# EAGLE schematic Schematic_Eagle (EAGLE 9.6.2)
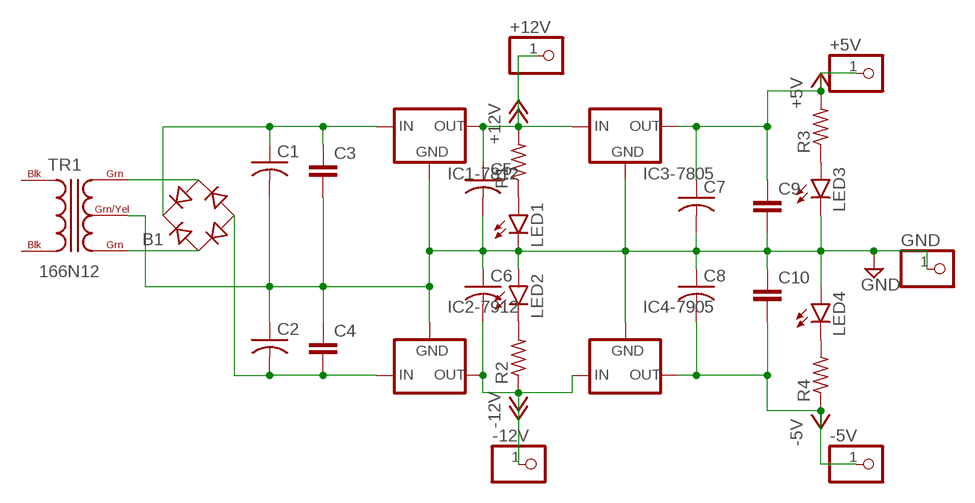
[diagram p0: schematic, sheet 1]

## Parts
+5V  PINHD-1X1  [1X01]
+12V  PINHD-1X1  [1X01]
-5V  PINHD-1X1  [1X01]
-12V  PINHD-1X1  [1X01]
B1  RB1A  [RB1A]
C1  C-US025-025X050  [C025-025X050]
C2  C-US025-025X050  [C025-025X050]
C3  C-EU025-025X050  [C025-025X050]
C4  C-EU025-025X050  [C025-025X050]
C5  C-US025-025X050  [C025-025X050]
C6  C-US025-025X050  [C025-025X050]
C7  C-US025-025X050  [C025-025X050]
C8  C-US025-025X050  [C025-025X050]
C9  C-EU025-025X050  [C025-025X050]
C10  C-EU025-025X050  [C025-025X050]
GND  PINHD-1X1  [1X01]
IC1-7812  78XXL  [78XXL]
IC2-7912  79XXL  [79XXL]
IC3-7805  78XXL  [78XXL]
IC4-7905  79XXL  [79XXL]
LED1  LED5MM  [LED5MM]
LED2  LED5MM  [LED5MM]
LED3  LED5MM  [LED5MM]
LED4  LED5MM  [LED5MM]
R1  R-US_0204/7  [0204/7]
R2  R-US_0204/7  [0204/7]
R3  R-US_0204/7  [0204/7]
R4  R-US_0204/7  [0204/7]
TR1  166N12  [C13H]

## Nets
+5V: +5V.1 C7.1 C9.1 IC3-7805.OUT R3.2
+12V: +12V.1 C5.1 IC1-7812.OUT IC3-7805.IN R1.2
-5V: -5V.1 C8.2 C10.2 IC4-7905.OUT R4.1
-12V: -12V.1 C6.2 IC2-7912.OUT IC4-7905.IN R2.1
GND: C1.2 C2.1 C3.2 C4.1 C5.2 C6.1 C7.2 C8.1 C9.2 C10.1 GND.1 IC1-7812.GND IC2-7912.GND IC3-7805.GND IC4-7905.GND LED1.K(C) LED2.A LED3.K(C) LED4.A TR1.GRN/YEL
N$1: B1.AC1 TR1.GRN@2(GRN)
N$2: B1.AC2 TR1.GRN@1(GRN)
N$3: B1.+ C1.1 C3.1 IC1-7812.IN
N$4: B1.- C2.2 C4.2 IC2-7912.IN
N$10: LED1.A R1.1
N$11: LED2.K(C) R2.2
N$13: LED3.A R3.1
N$18: LED4.K(C) R4.2
Unconnected: TR1.BLK@1(BLK) TR1.BLK@2(BLK)

## Library data of the parts
+5V +12V -5V -12V GND = pinhead:PINHD-1X1: PIN HEADER
B1 = rectifier:RB1A: RECTIFIER 1 A
C1 C2 C5-C8 = rcl:C-US: CAPACITOR, American symbol; SPICEPREFIX: C
C3 C4 C9 C10 = rcl:C-EU: CAPACITOR, European symbol; SPICEPREFIX: C
IC1-7812 IC3-7805 = v-reg:78XXL: VOLTAGE REGULATOR
IC2-7912 IC4-7905 = v-reg:79XXL: VOLTAGE REGULATOR
LED1-LED4 = led:LED: LED OSRAM: - CHIPLED LG R971, LG N971, LY N971, LG Q971, LY Q971, LO R971, LY R971 LH N974, LH R974 LS Q976, LO Q976, LY Q976 LO Q996 - Hyper CHIPLED LW Q18S LB Q993, LB Q99A, LB R99A - SideLED LS A670, LO A670, LY A670, LG A670, LP A670 LB A673, LV A673, LT A673, LW A673 LH A674 LY A675 LS A676, LA A676, LO A676, LY A676, LW A676 LS A679, LY A679, LG A679 - Hyper Micro SIDELED® LS Y876, LA Y876, LO Y876, LY Y876 LT Y87S - SmartLED LW L88C, LW L88S LB L89C, LB L89S, LG L890 LS L89K, LO L89K, LY L89K LS L896, LA L896, LO L896, LY L896 - TOPLED LS T670, LO T670, LY T670, LG T670, LP T670 LSG T670, LSP T670, LSY T670, LOP T670, LYG T670 LG T671, LOG T671, LSG T671 LB T673, LV T673, LT T673, LW T673 LH T674 LS T676, LA T676, LO T676, LY T676, LB T676, LH T676, LSB T676, LW T676 LB T67C, LV T67C, LT T67C, LS T67K, LO T67K, LY T67K, LW E67C LS E67B, LA E67B, LO E67B, LY E67B, LB E67C, LV E67C, LT E67C LW T67C LS T679, LY T679, LG T679 LS T770, LO T770, LY T770, LG T770, LP T770 LB T773, LV T773, LT T773, LW T773 LH T774 LS E675, LA E675, LY E675, LS T675 LS T776, LA T776, LO T776, LY T776, LB T776 LHGB T686 LT T68C, LB T68C - Hyper Mini TOPLED® LB M676 - Mini TOPLED Santana® LG M470 LS M47K, LO M47K, LY M47K Source: http://www.osram.convergy.de LUXEON: - LUMILED® LXK2-PW12-R00, LXK2-PW12-S00, LXK2-PW14-U00, LXK2-PW14-V00 LXK2-PM12-R00, LXK2-PM12-S00, LXK2-PM14-U00 LXK2-PE12-Q00, LXK2-PE12-R00, LXK2-PE12-S00, LXK2-PE14-T00, LXK2-PE14-U00 LXK2-PB12-K00, LXK2-PB12-L00, LXK2-PB12-M00, LXK2-PB14-N00, LXK2-PB14-P00, LXK2-PB14-Q00 LXK2-PR12-L00, LXK2-PR12-M00, LXK2-PR14-Q00, LXK2-PR14-R00 LXK2-PD12-Q00, LXK2-PD12-R00, LXK2-PD12-S00 LXK2-PH12-R00, LXK2-PH12-S00 LXK2-PL12-P00, LXK2-PL12-Q00, LXK2-PL12-R00 Source: www.luxeon.com KINGBRIGHT: KA-3528ASYC Source: www.kingbright.com
R1-R4 = rcl:R-US_: RESISTOR, American symbol; SPICEPREFIX: R
TR1 = trafo-hammondmfg:166: OPEN STYLE FILAMENT & L.V. RECTIFIER USE TRANSFORMERS Economical single primnary 115VAC, 60 Hz or 117 VAC 50/60 Hz Source: Data sheet <http://www.hammondmfg.com/166.htm>